# EasyEDA schematic schematic.json

## Sheets
1 Main: TITLE: Hextech Main; REV: 1.0; Date: 2019-08-17; Sheet: 1/4; Drawn By: Calin; Company: Motarelu
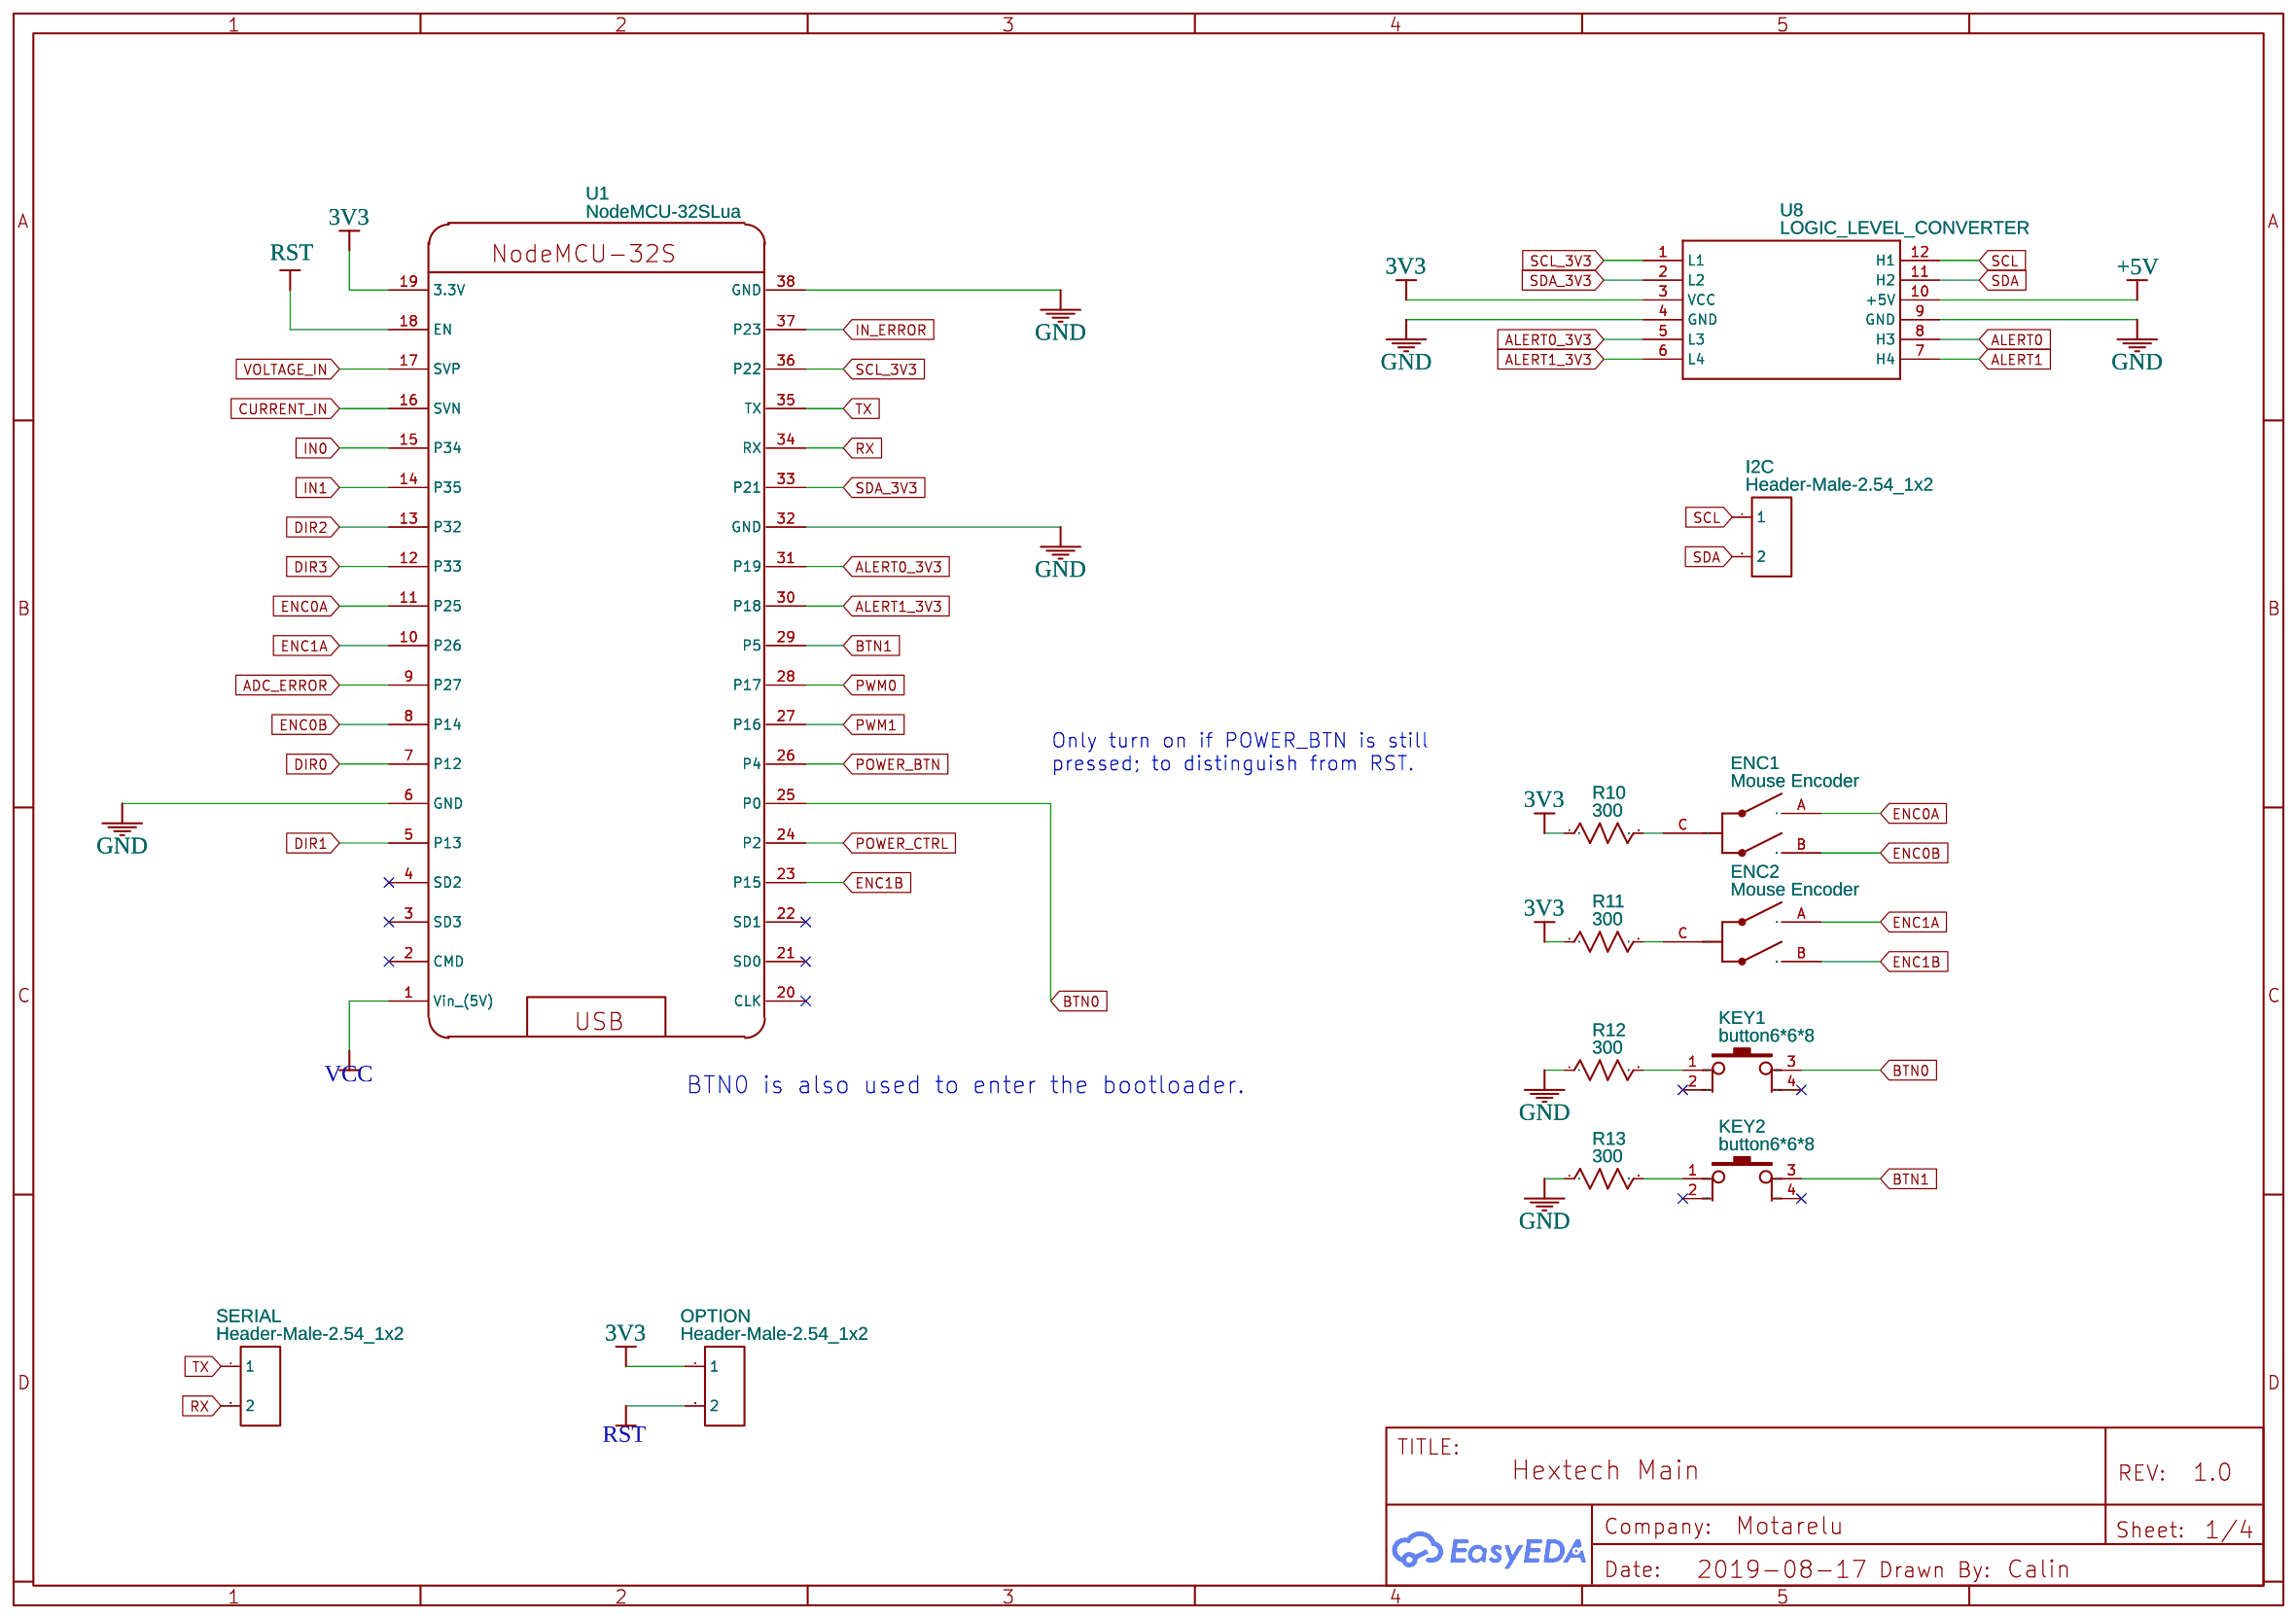
[diagram p0: Main]
2 Sensors: TITLE: Sensors; Date: 2019-08-20; Sheet: 2/4
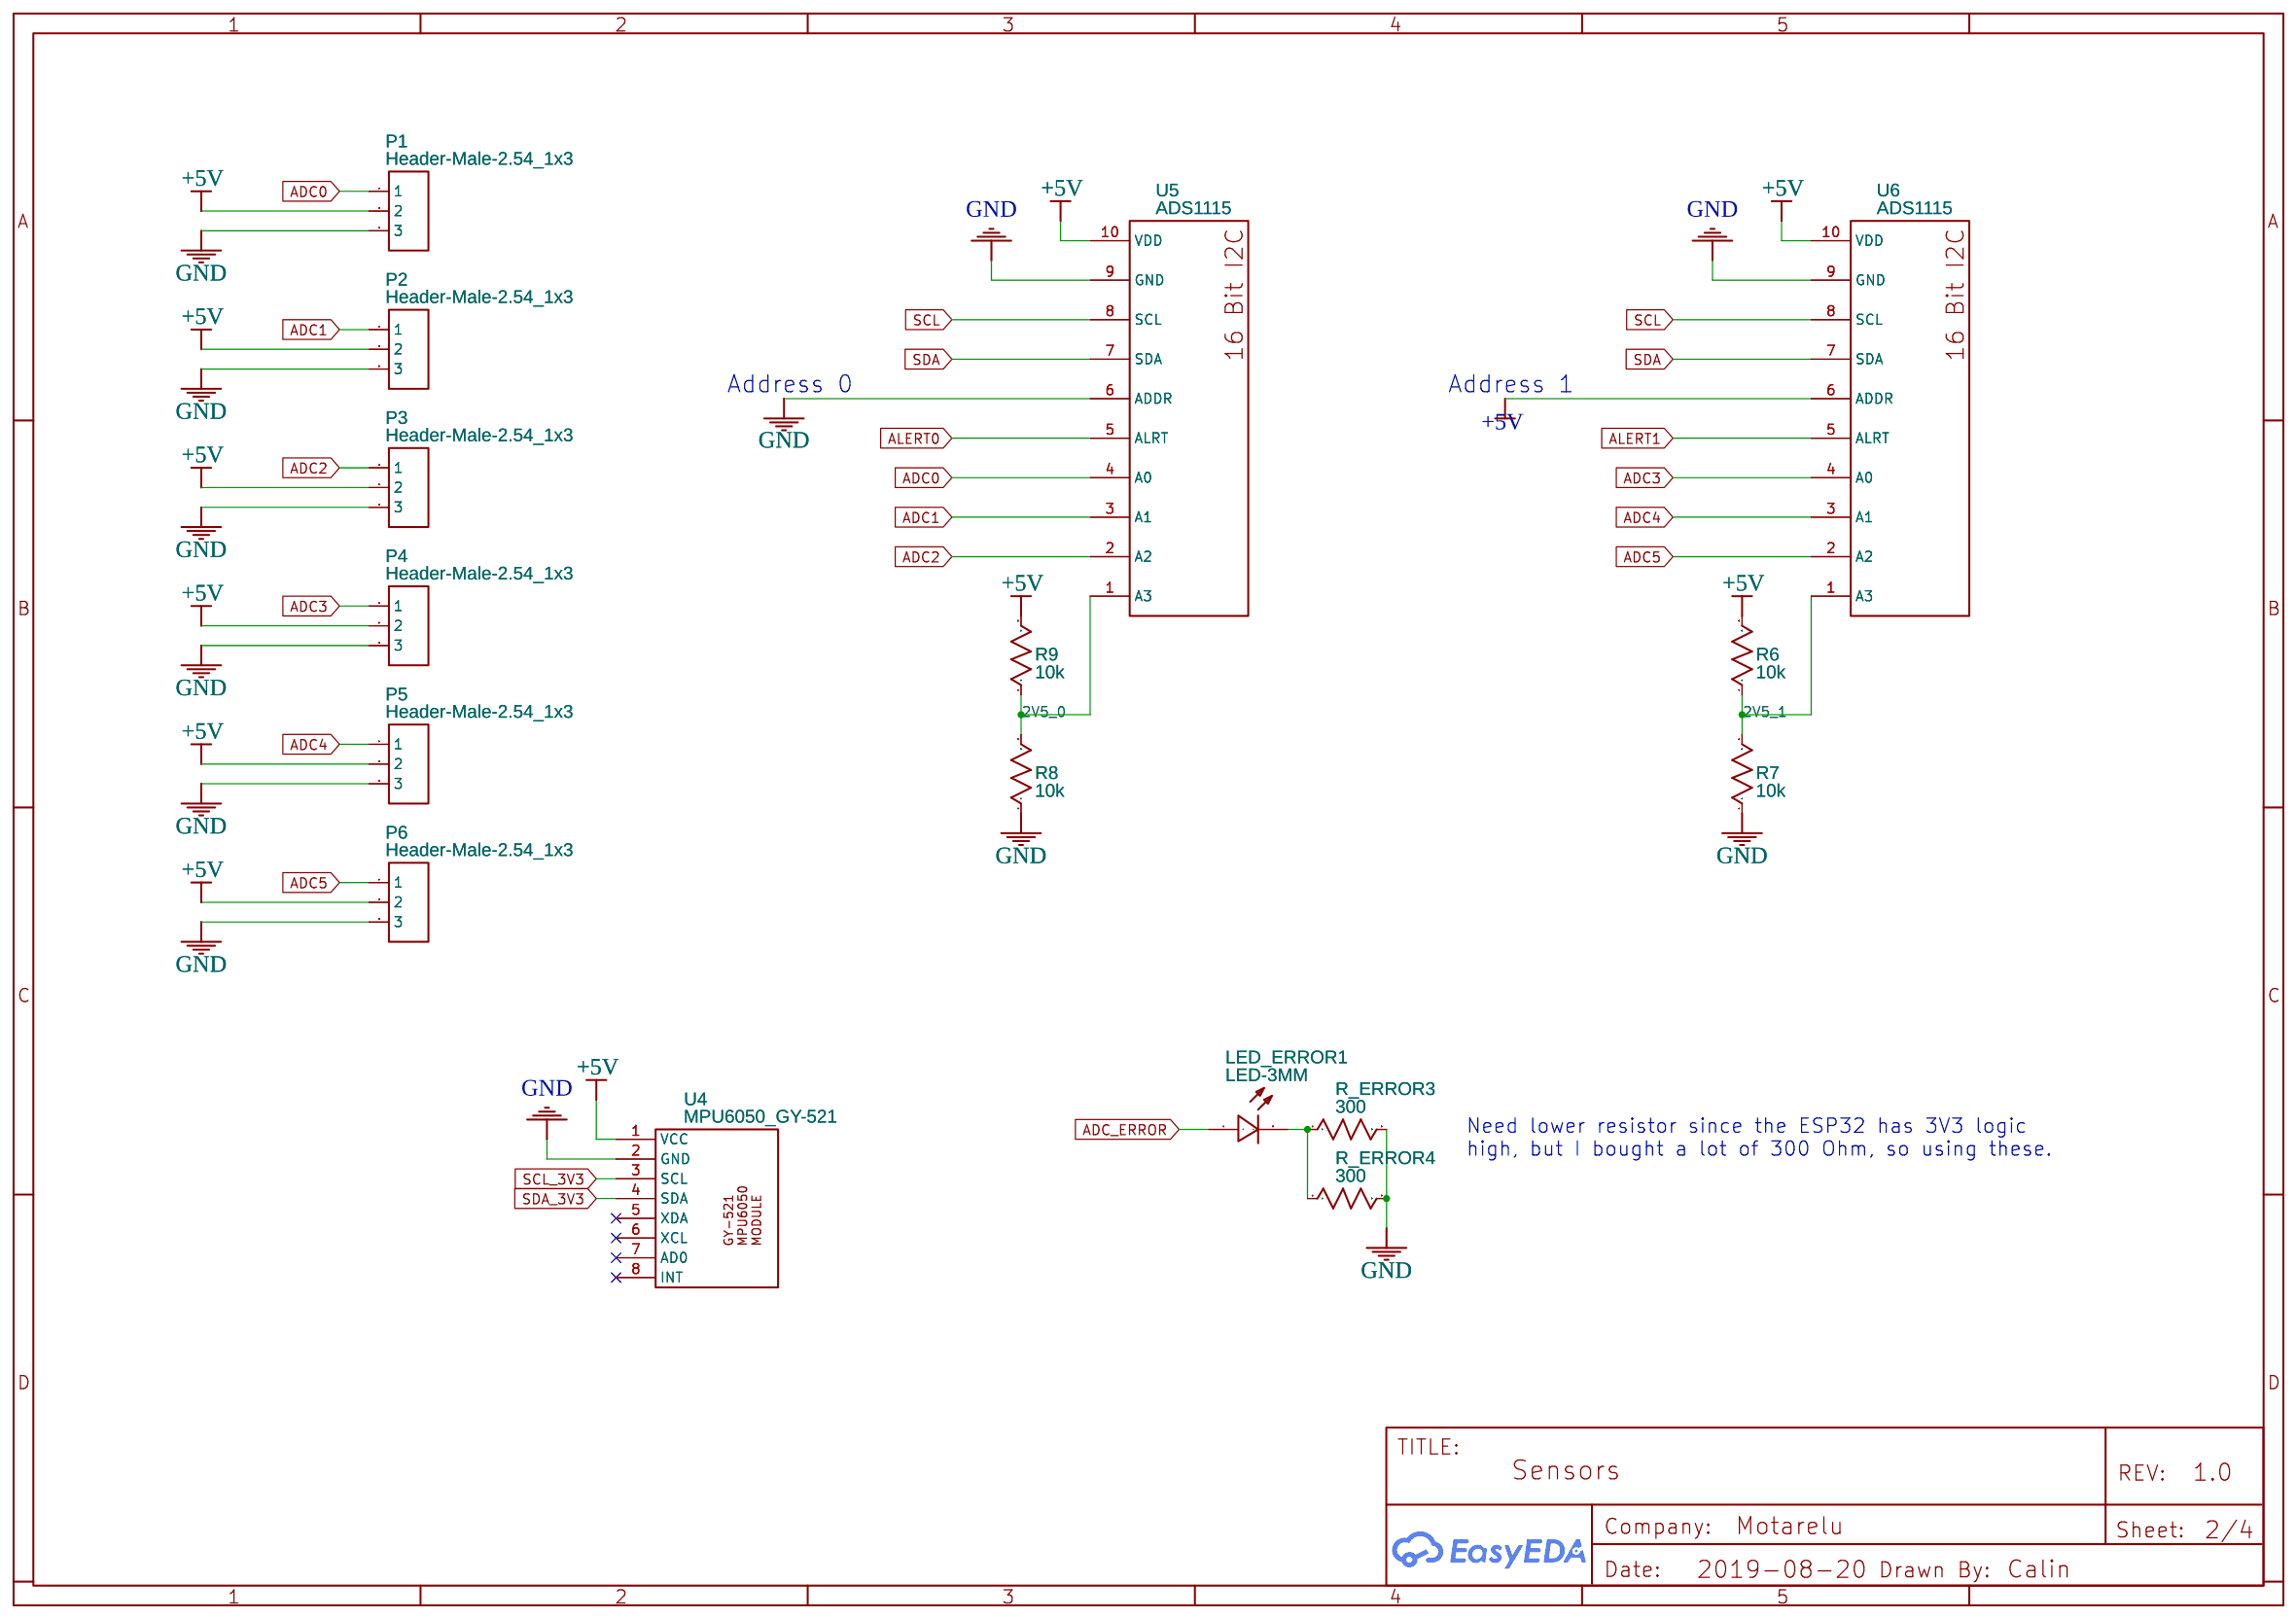
[diagram p1: Sensors]
3 Power: TITLE: Power control; Date: 2019-08-20; Sheet: 3/4
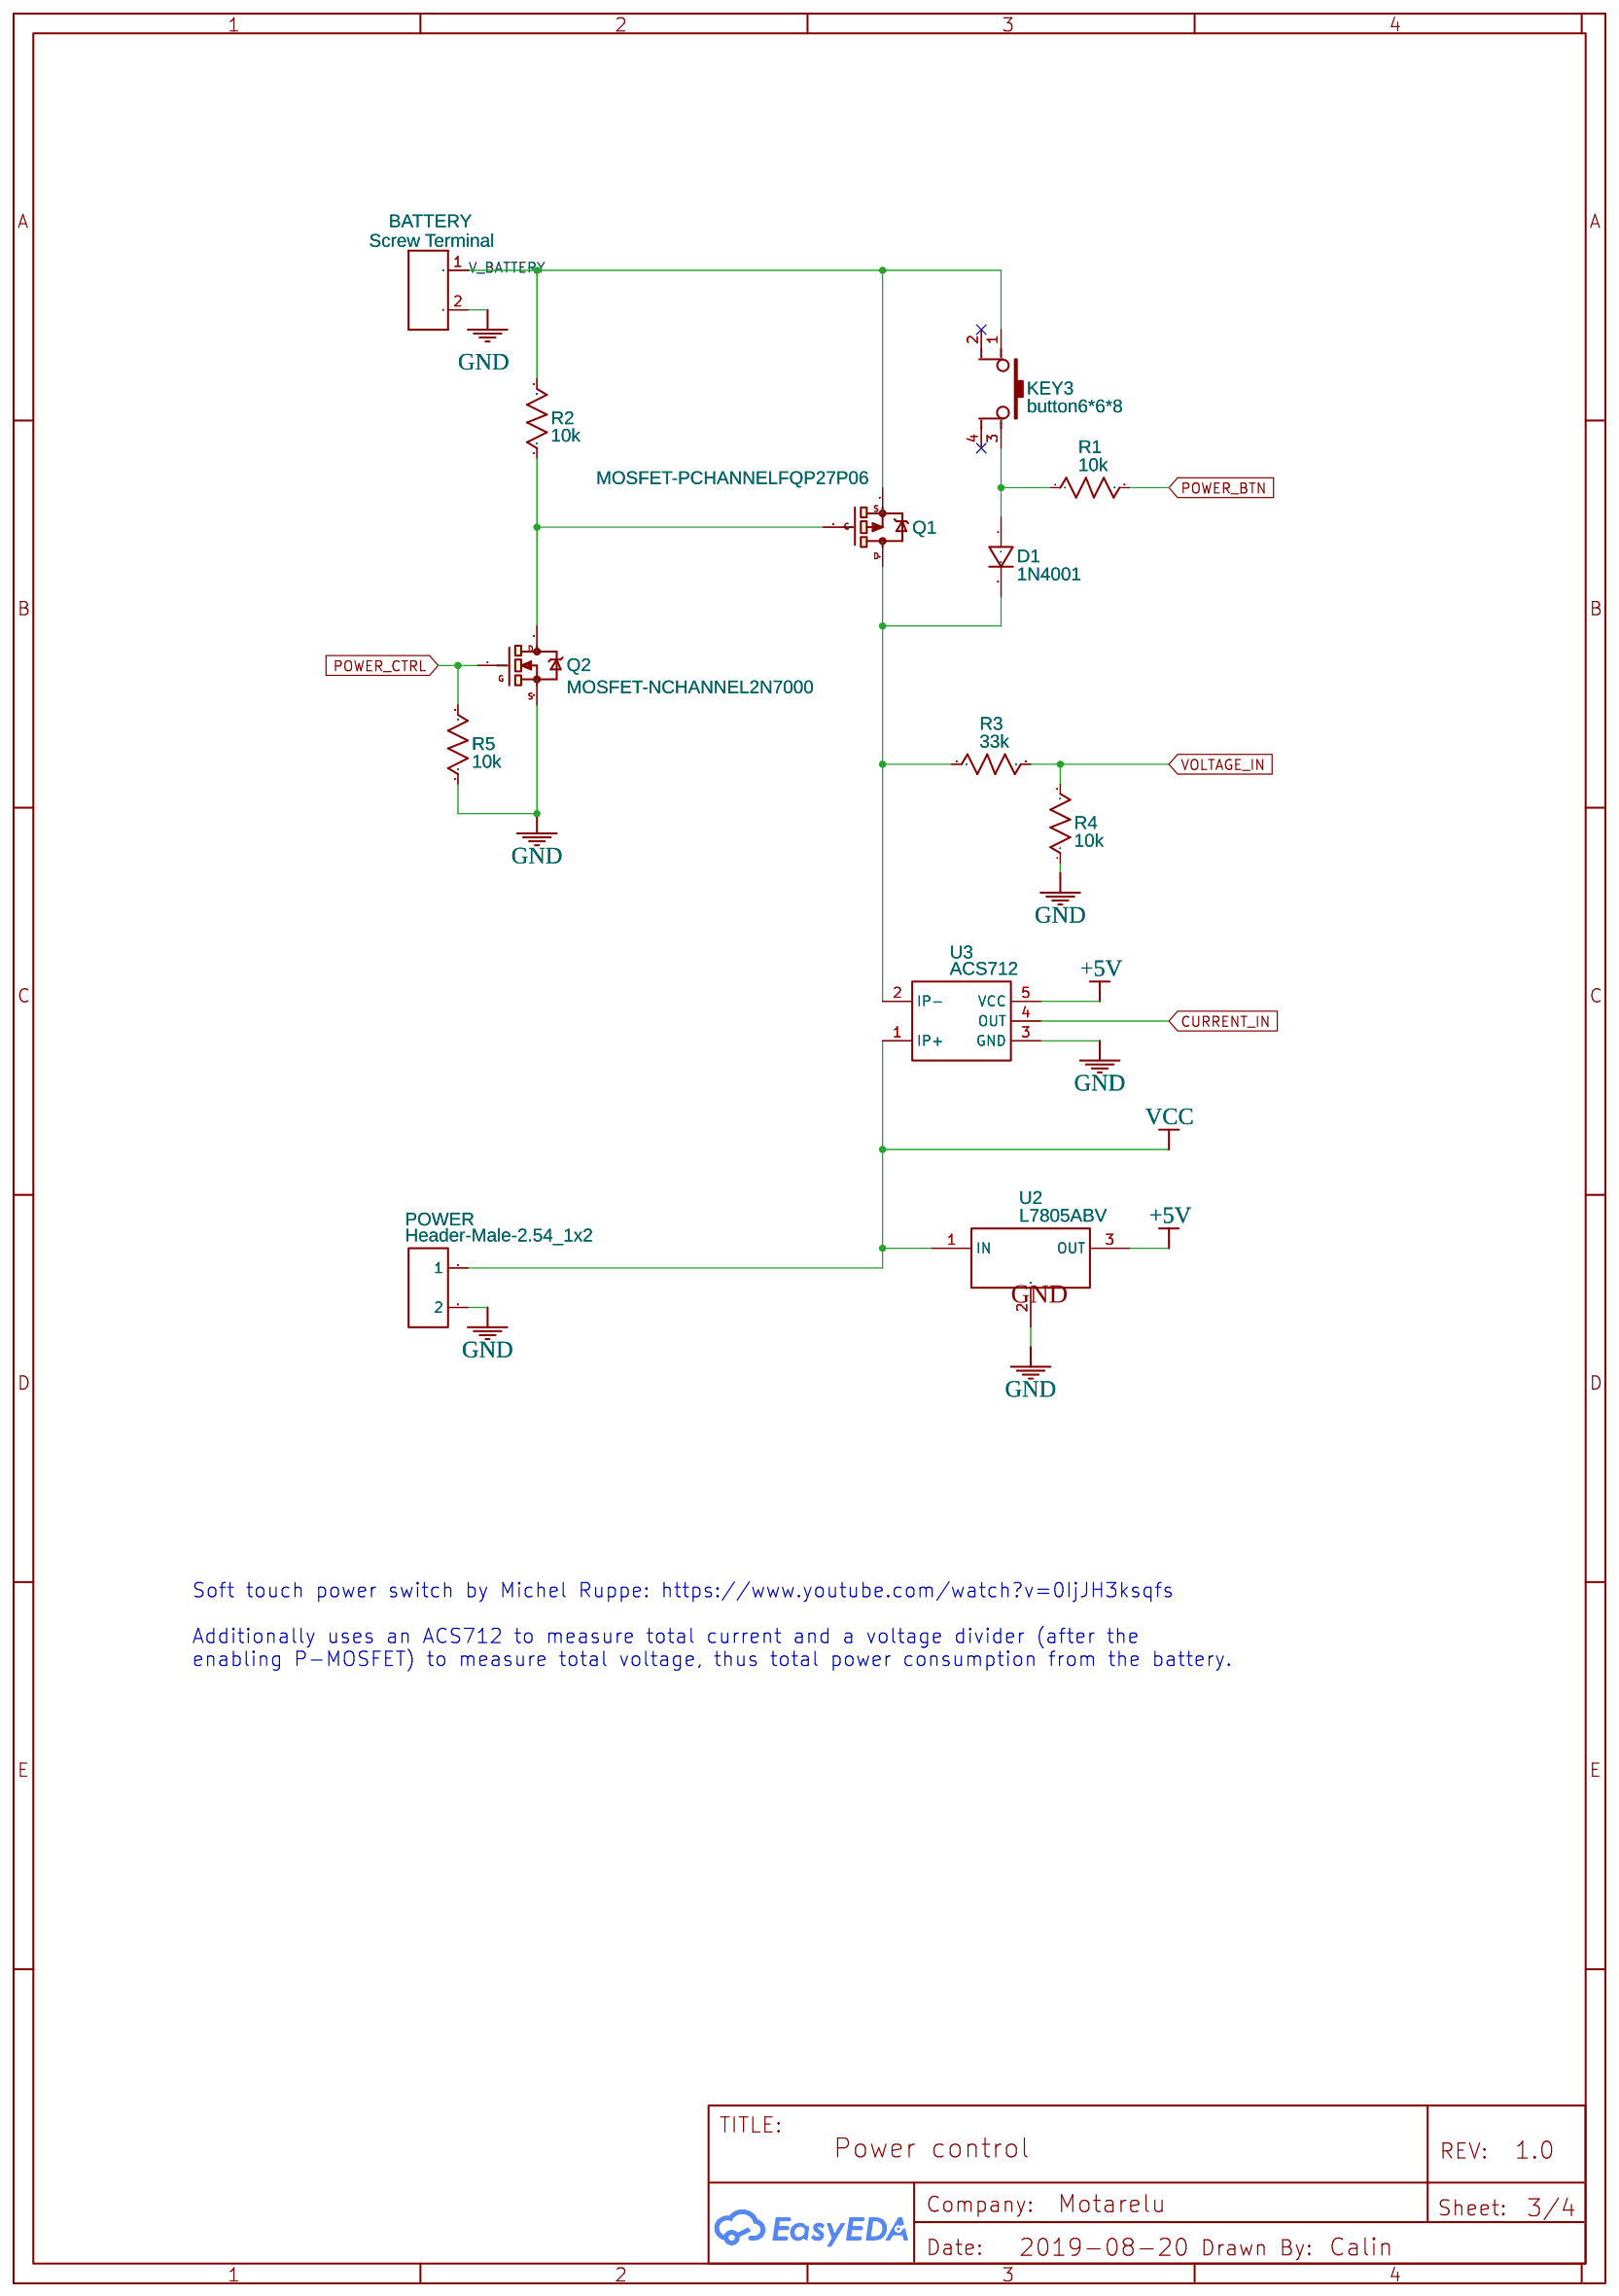
[diagram p2: Power]
4 Motors: TITLE: Motors; Date: 2019-08-20; Sheet: 4/4
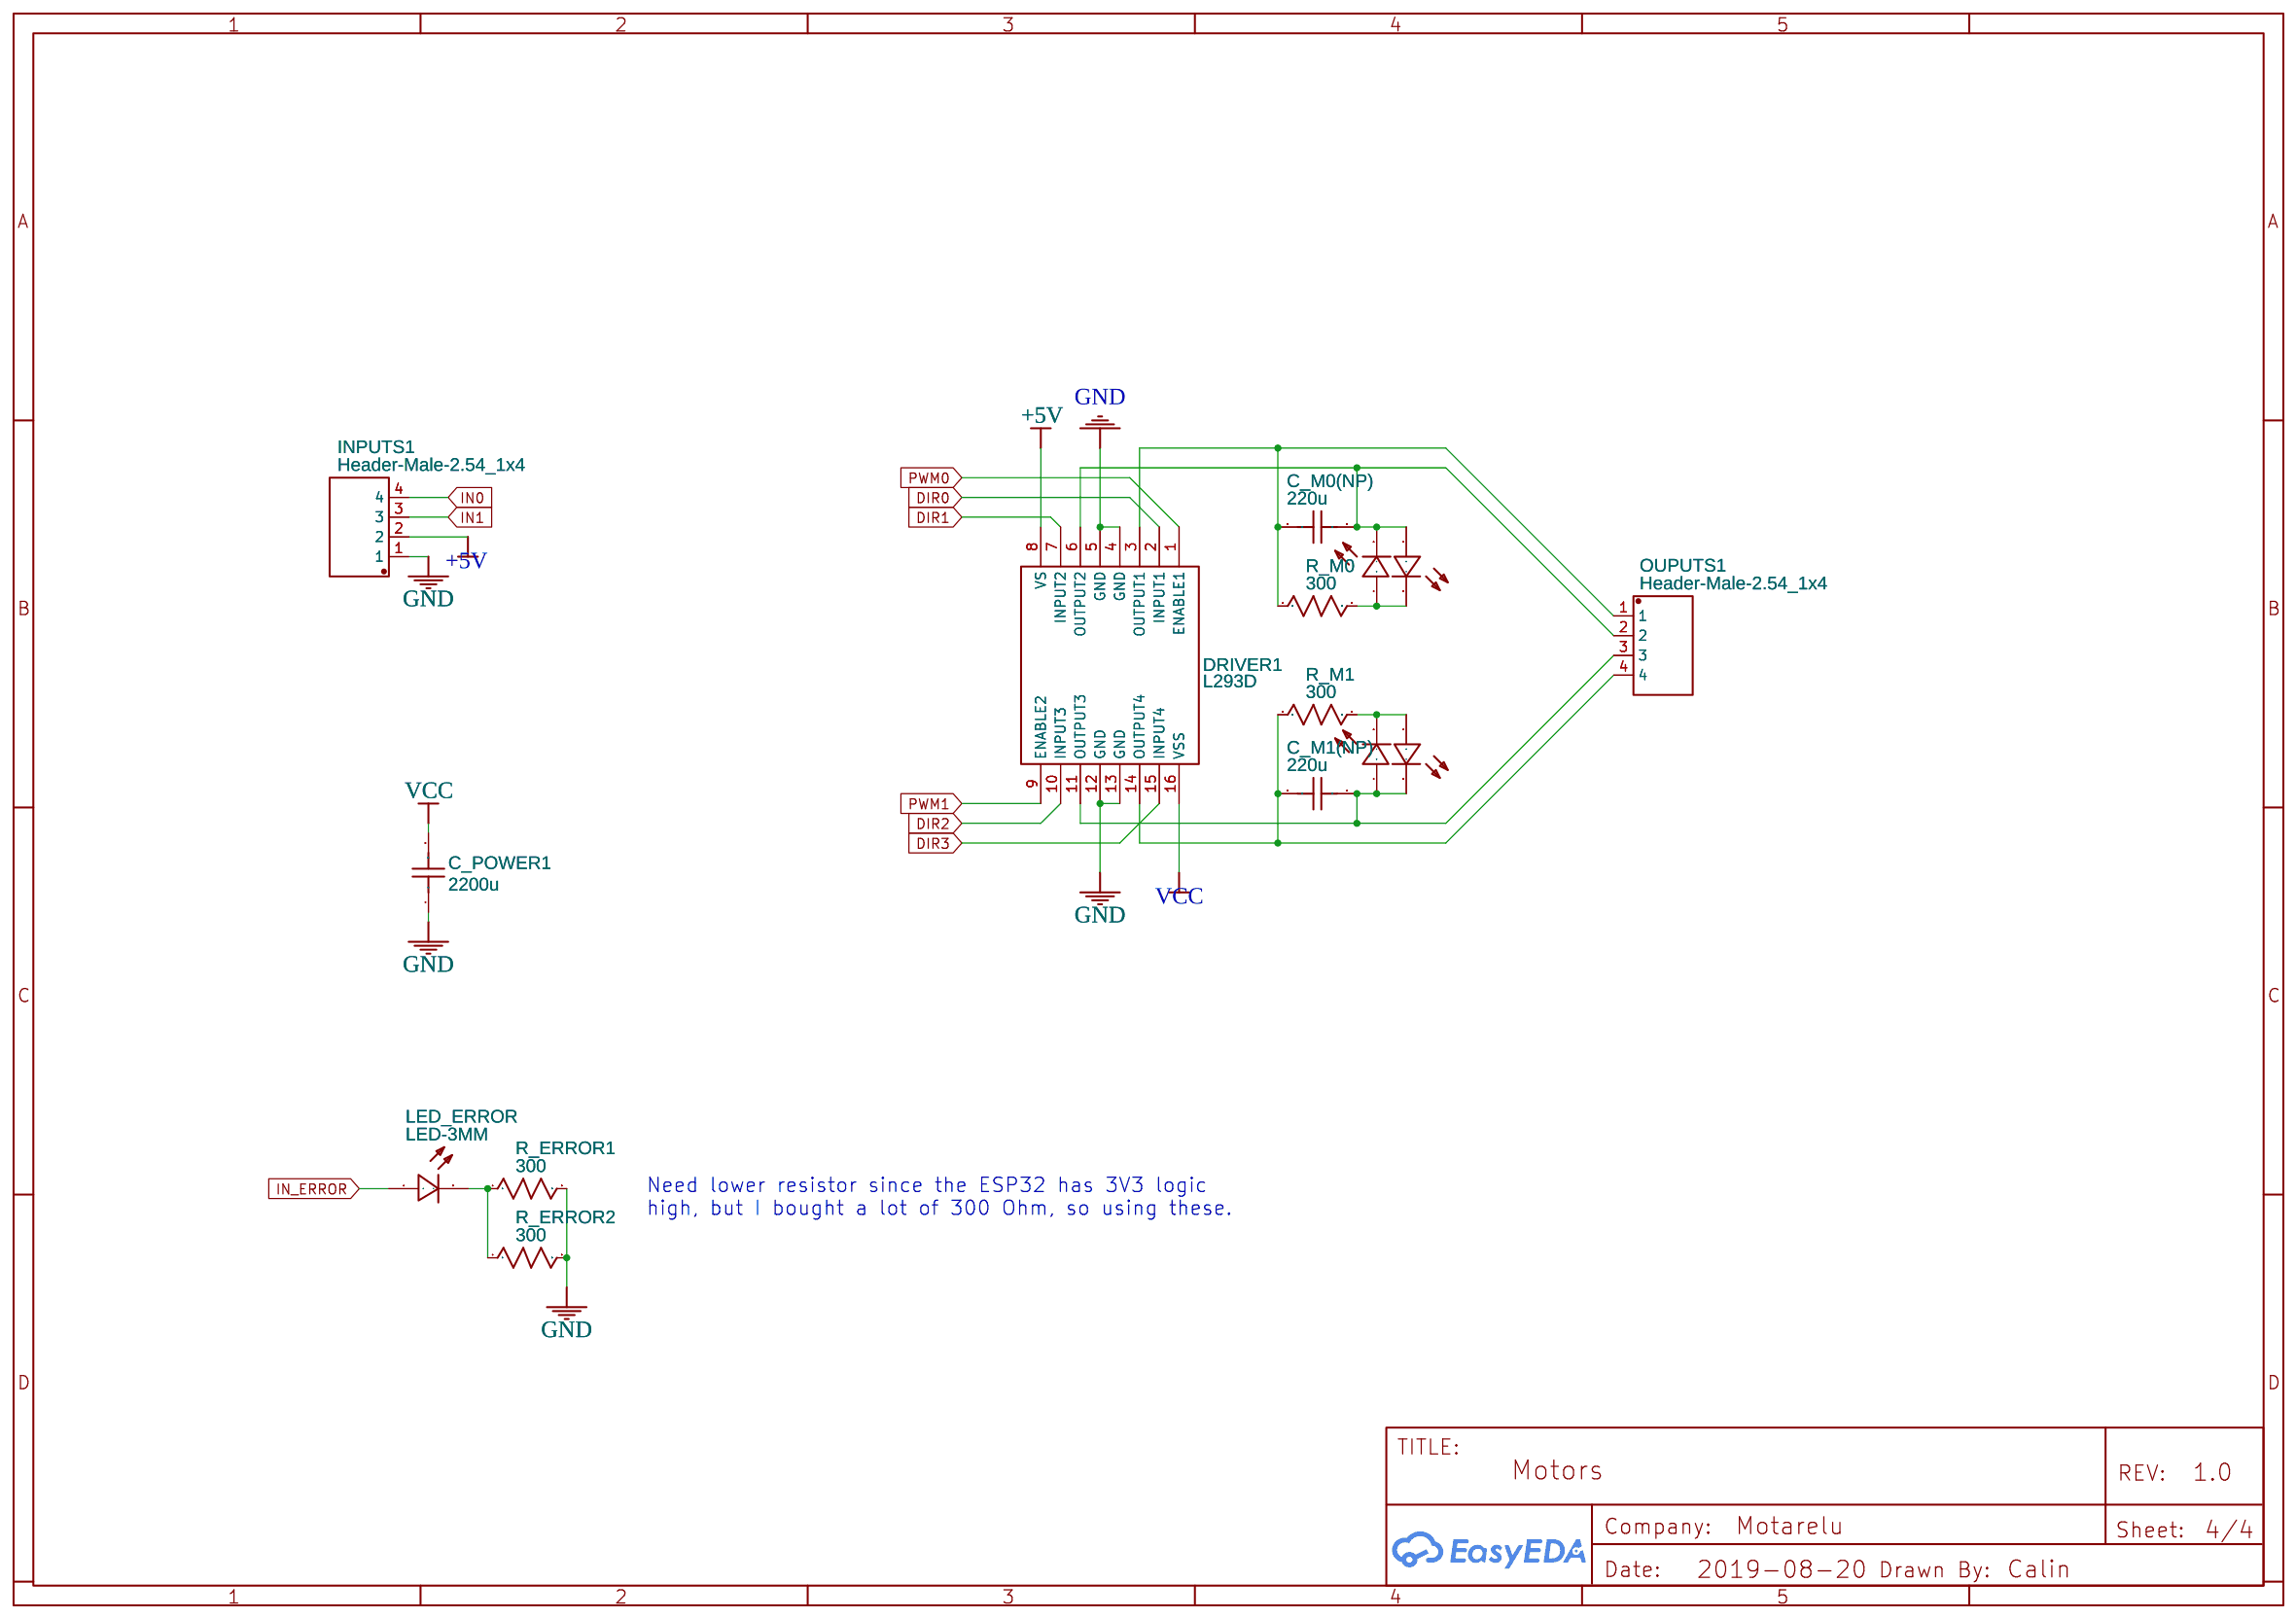
[diagram p3: Motors]

## Parts
sheet Main
ENC1  Mouse Encoder  [MOUSE ENCODER]
ENC2  Mouse Encoder  [MOUSE ENCODER]
I2C  Header-Male-2.54_1x2  [HDR-2X1/2.54]
KEY1  button6*6*8  [KEY-6.0*6.0-2]
KEY2  button6*6*8  [KEY-6.0*6.0-2]
OPTION  Header-Male-2.54_1x2  [HDR-2X1/2.54]
R10  300  [AXIAL-0.3]
R11  300  [AXIAL-0.3]
R12  300  [AXIAL-0.3]
R13  300  [AXIAL-0.3]
SERIAL  Header-Male-2.54_1x2  [HDR-2X1/2.54]
U1  NodeMCU-32SLua  [NODEMCU-32SLUA]
U8  LOGIC_LEVEL_CONVERTER  [LOGIC_LEVEL_CONVERTER]
sheet Motors
C_M0(NP)  220u  [SIDECAP_10X16]
C_M1(NP)  220u  [SIDECAP_10X16]
C_POWER1  2200u  [SIDECAP_13X21]
DRIVER1  L293D  [DIP-16]
INPUTS1  Header-Male-2.54_1x4  [DIP-1X4P-2.54MM-M]
LED_ERROR  LED-3MM  [LED-3MM/2.54]
LED_M0A  LED-3MM  [LED-3MM/2.54]
LED_M0B  LED-3MM  [LED-3MM/2.54]
LED_M1A  LED-3MM  [LED-3MM/2.54]
LED_M1B  LED-3MM  [LED-3MM/2.54]
OUPUTS1  Header-Male-2.54_1x4  [DIP-1X4P-2.54MM-M]
R_ERROR1  300  [AXIAL-0.3]
R_ERROR2  300  [AXIAL-0.3]
R_M0  300  [AXIAL-0.3]
R_M1  300  [AXIAL-0.3]
sheet Power
BATTERY  Screw Terminal  [H2-5.0-10.5X8.0MM]
D1  1N4001  [DO-41]
KEY3  button6*6*8  [KEY-6.0*6.0-2]
POWER  Header-Male-2.54_1x2  [HDR-2X1/2.54]
Q1  MOSFET-PCHANNELFQP27P06  [TO220V]
Q2  MOSFET-NCHANNEL2N7000  [TO-92]
R1  10k  [AXIAL-0.3]
R2  10k  [AXIAL-0.3]
R3  33k  [AXIAL-0.3]
R4  10k  [AXIAL-0.3]
R5  10k  [AXIAL-0.3]
U2  L7805ABV  [TO-220(TO-220-3)]
U3  ACS712  [ACS712_MODULE]
sheet Sensors
LED_ERROR1  LED-3MM  [LED-3MM/2.54]
P1  Header-Male-2.54_1x3  [HDR-3X1/2.54]
P2  Header-Male-2.54_1x3  [HDR-3X1/2.54]
P3  Header-Male-2.54_1x3  [HDR-3X1/2.54]
P4  Header-Male-2.54_1x3  [HDR-3X1/2.54]
P5  Header-Male-2.54_1x3  [HDR-3X1/2.54]
P6  Header-Male-2.54_1x3  [HDR-3X1/2.54]
R6  10k  [AXIAL-0.3]
R7  10k  [AXIAL-0.3]
R8  10k  [AXIAL-0.3]
R9  10k  [AXIAL-0.3]
R_ERROR3  300  [AXIAL-0.3]
R_ERROR4  300  [AXIAL-0.3]
U4  MPU6050_GY-521  [MPU6050_GY-521_PCB]
U5  ADS1115  [ADS1115]
U6  ADS1115  [ADS1115]

## Library data of the parts
ENC1 ENC2 = -: Contributor: AndreyII
I2C OPTION POWER SERIAL = -: Supplier: LCSC; Manufacturer: TE Connectivity; Manufacturer Part: 826629-2; image: //image.lceda.cn/szlcsc/C86471.jpg; Supplier Part: C86471
KEY1-KEY3 = -: Supplier Part: C59982; Supplier: LCSC; Manufacturer: ReliaPro; image: http://image.lceda.cn/szlcsc/C59982.jpg
R1-R13 = Res_AXIAL-0.3(1/8W)_US
U1 = -: Supplier: LCSC; Supplier Part: C111436; Manufacturer: Ai-Thinker; Contributor: EasyEDA; link: https://lcsc.com/product-detail/Modules_NodeMCU-32S-Lua_C111436.html
U8 = -: Logic Level Converter (3.3v - 5v); Contributor: Siegel IFSC
C_M0(NP) C_M1(NP) C_POWER1 = Cap_RAD-0.1_US: Manufacturer Part: ?
DRIVER1 = -: Contributor: pitreluc; Supplier: LCSC; Manufacturer: STMicroelectronics; image: //image.lceda.cn/szlcsc/C12340.jpg; Supplier Part: C12340
INPUTS1 OUPUTS1 = -: Supplier: LCSC; Manufacturer: Ckmtw; Manufacturer Part: 210S-1*4P L=11.6MMGold-plated black; Contributor: LCSC; Supplier Part: C124378
LED_ERROR LED_ERROR1 LED_M0A LED_M0B LED_M1A LED_M1B = -: Supplier: LCSC; Manufacturer: EVERLIGHT; Manufacturer Part: 204-10SURD/S530-A3; Supplier Part: C99772
R_ERROR1-R_ERROR4 R_M0 R_M1 = Res_AXIAL-0.3(1/8W)_US: Manufacturer Part: ?
BATTERY = -: Manufacturer Part: ?
D1 = -: Supplier Part: C169150; Supplier: LCSC; Manufacturer: DIOFIT; Contributor: LCSC
Q1 = -: Generic PMOSFET; Contributor: SparkFun
Q2 = -: Common NMOSFET Parts; Contributor: SparkFun
U2 = -: Supplier: LCSC; Manufacturer: STMicroelectronics; image: //image.lceda.cn/szlcsc/C16807.jpg; Supplier Part: C16807
U3 = -: Contributor: soppmail; project: www.ardumower.de
P1-P6 = -: Supplier: LCSC; Manufacturer: BOOMELE; Manufacturer Part: Header2.54mm 1*3P; image: //image.lceda.cn/szlcsc/C49257.jpg; Supplier Part: C49257
U4 = -: Manufacturer Part: GY-521; Supplier Part: GY-521; link: Beschleunigungssensor Breakout; subpart_no: 1; Contributor: andy-thx
U5 U6 = -: Supplier Part: 1528-1461-ND; Supplier: Digi-Key; link: https://www.digikey.com/products/en/development-boards-kits-programmers/evaluation-boards-analog-to-digital-converters-adcs/791?k=adafruit%201085; Contributor: minnkid

## Nets
2V5_0: R8.2 R9.1 U5.1(A3)
2V5_1: R6.1 R7.2 U6.1(A3)
3V3: OPTION.1 R10.1 R11.1 U1.19(3.3V) U8.3(VCC)
+5V: DRIVER1.8(VS) INPUTS1.2 P1.2 P2.2 P3.2 P4.2 P5.2 P6.2 R6.2 R9.2 U2.3(OUT) U3.5(VCC) U4.1(VCC) U5.10(VDD) U6.6(ADDR) U6.10(VDD) U8.10(+5V)
GND: BATTERY.2 C_POWER1.1 DRIVER1.4(GND) DRIVER1.5(GND) DRIVER1.12(GND) DRIVER1.13(GND) INPUTS1.1 P1.3 P2.3 P3.3 P4.3 P5.3 P6.3 POWER.2 Q2.1(S) R4.1 R5.1 R7.1 R8.1 R12.1 R13.1 R_ERROR1.2 R_ERROR2.2 R_ERROR3.2 R_ERROR4.2 U1.6(GND) U1.32(GND) U1.38(GND) U2.2(GND) U3.3(GND) U4.2(GND) U5.6(ADDR) U5.9(GND) U6.9(GND) U8.4(GND) U8.9(GND)
VCC: C_POWER1.2 DRIVER1.16(VSS) POWER.1 U1.1(Vin (5V)) U2.1(IN) U3.1(IP+)
ADC0: P1.1 U5.4(A0)
ADC1: P2.1 U5.3(A1)
ADC2: P3.1 U5.2(A2)
ADC3: P4.1 U6.4(A0)
ADC4: P5.1 U6.3(A1)
ADC5: P6.1 U6.2(A2)
ADC_ERROR: LED_ERROR1.1(+) U1.9(P27)
ALERT0: U5.5(ALRT) U8.8(H3)
ALERT0_3V3: U1.31(P19) U8.5(L3)
ALERT1: U6.5(ALRT) U8.7(H4)
ALERT1_3V3: U1.30(P18) U8.6(L4)
BTN0: KEY1.3 U1.25(P0)
BTN1: KEY2.3 U1.29(P5)
CURRENT_IN: U1.16(SVN) U3.4(OUT)
DIR0: DRIVER1.2(INPUT1) U1.7(P12)
DIR1: DRIVER1.7(INPUT2) U1.5(P13)
DIR2: DRIVER1.10(INPUT3) U1.13(P32)
DIR3: DRIVER1.15(INPUT4) U1.12(P33)
ENC0A: ENC1.A U1.11(P25)
ENC0B: ENC1.B U1.8(P14)
ENC1A: ENC2.A U1.10(P26)
ENC1B: ENC2.B U1.23(P15)
IN0: INPUTS1.4 U1.15(P34)
IN1: INPUTS1.3 U1.14(P35)
IN_ERROR: LED_ERROR.1(+) U1.37(P23)
POWER_BTN: R1.2 U1.26(P4)
POWER_CTRL: Q2.2(G) R5.2 U1.24(P2)
PWM0: DRIVER1.1(ENABLE1) U1.28(P17)
PWM1: DRIVER1.9(ENABLE2) U1.27(P16)
RST: OPTION.2 U1.18(EN)
RX: SERIAL.2 U1.34(RX)
SCL: I2C.1 U5.8(SCL) U6.8(SCL) U8.12(H1)
SCL_3V3: U1.36(P22) U4.3(SCL) U8.1(L1)
SDA: I2C.2 U5.7(SDA) U6.7(SDA) U8.11(H2)
SDA_3V3: U1.33(P21) U4.4(SDA) U8.2(L2)
TX: SERIAL.1 U1.35(TX)
V_BATTERY: BATTERY.1 KEY3.1 Q1.3(S) R2.2
VOLTAGE_IN: R3.2 R4.2 U1.17(SVP)
Net-(C_M0(NP)-1): C_M0(NP).1 DRIVER1.6(OUTPUT2) LED_M0A.2(-) LED_M0B.1(+) OUPUTS1.2
Net-(C_M0(NP)-2): C_M0(NP).2 DRIVER1.3(OUTPUT1) OUPUTS1.1 R_M0.1
Net-(C_M1(NP)-1): C_M1(NP).1 DRIVER1.11(OUTPUT3) LED_M1A.1(+) LED_M1B.2(-) OUPUTS1.3
Net-(C_M1(NP)-2): C_M1(NP).2 DRIVER1.14(OUTPUT4) OUPUTS1.4 R_M1.1
Net-(D1-1): D1.1 KEY3.3 R1.1
Net-(D1-2): D1.2 Q1.2(D) R3.1 U3.2(IP-)
Net-(ENC1-C): ENC1.C R10.2
Net-(ENC2-C): ENC2.C R11.2
Net-(KEY1-1): KEY1.1 R12.2
Net-(KEY2-1): KEY2.1 R13.2
Net-(LED_ERROR1-2): LED_ERROR1.2(-) R_ERROR3.1 R_ERROR4.1
Net-(LED_ERROR-2): LED_ERROR.2(-) R_ERROR1.1 R_ERROR2.1
Net-(LED_M0A-1): LED_M0A.1(+) LED_M0B.2(-) R_M0.2
Net-(LED_M1A-2): LED_M1A.2(-) LED_M1B.1(+) R_M1.2
Net-(Q1-1): Q1.1(G) Q2.3(D) R2.1

Not connected (* = marked no-connect by the designer): KEY1 2* 4*; KEY2 2* 4*; KEY3 2* 4*; U1 2(CMD)* 3(SD3)* 4(SD2)* 20(CLK)* 21(SD0)* 22(SD1)*; U4 5(XDA)* 6(XCL)* 7(AD0)* 8(INT)*

## Notes on the sheets
sheet 1
- Only turn on if POWER_BTN is still
  pressed; to distinguish from RST.
- BTN0 is also used to enter the bootloader.
sheet 2
- Address 0
- Address 1
- Need lower resistor since the ESP32 has 3V3 logic
  high, but I bought a lot of 300 Ohm, so using these.
sheet 3
- Soft touch power switch by Michel Ruppe: https://www.youtube.com/watch?v=0IjJH3ksqfs
  Additionally uses an ACS712 to measure total current and a voltage divider (after the
  enabling P-MOSFET) to measure total voltage, thus total power consumption from the battery.
sheet 4
- Need lower resistor since the ESP32 has 3V3 logic
  high, but I bought a lot of 300 Ohm, so using these.
